# Altium schematic sheet Motor Controller.SchDoc: Motor Controller
size A2; Author: Adin Ackerman; DrawnBy: Adin Ackerman; SheetNumber: 1; SheetTotal: 1
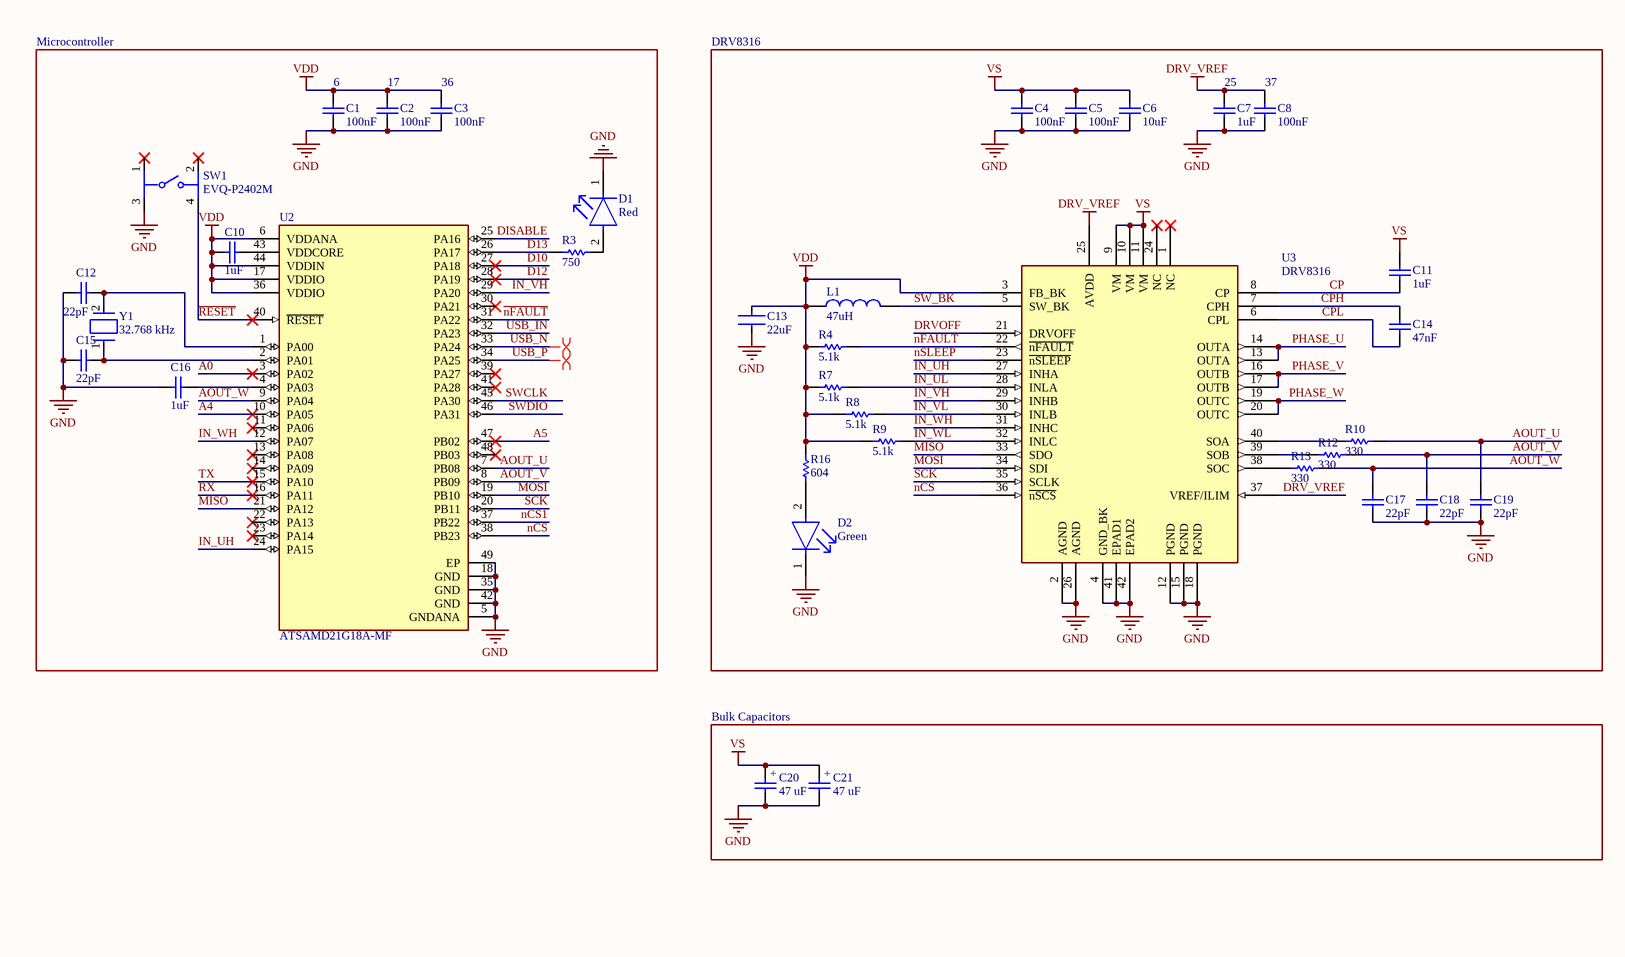
[diagram p0: Motor Controller.SchDoc, left]
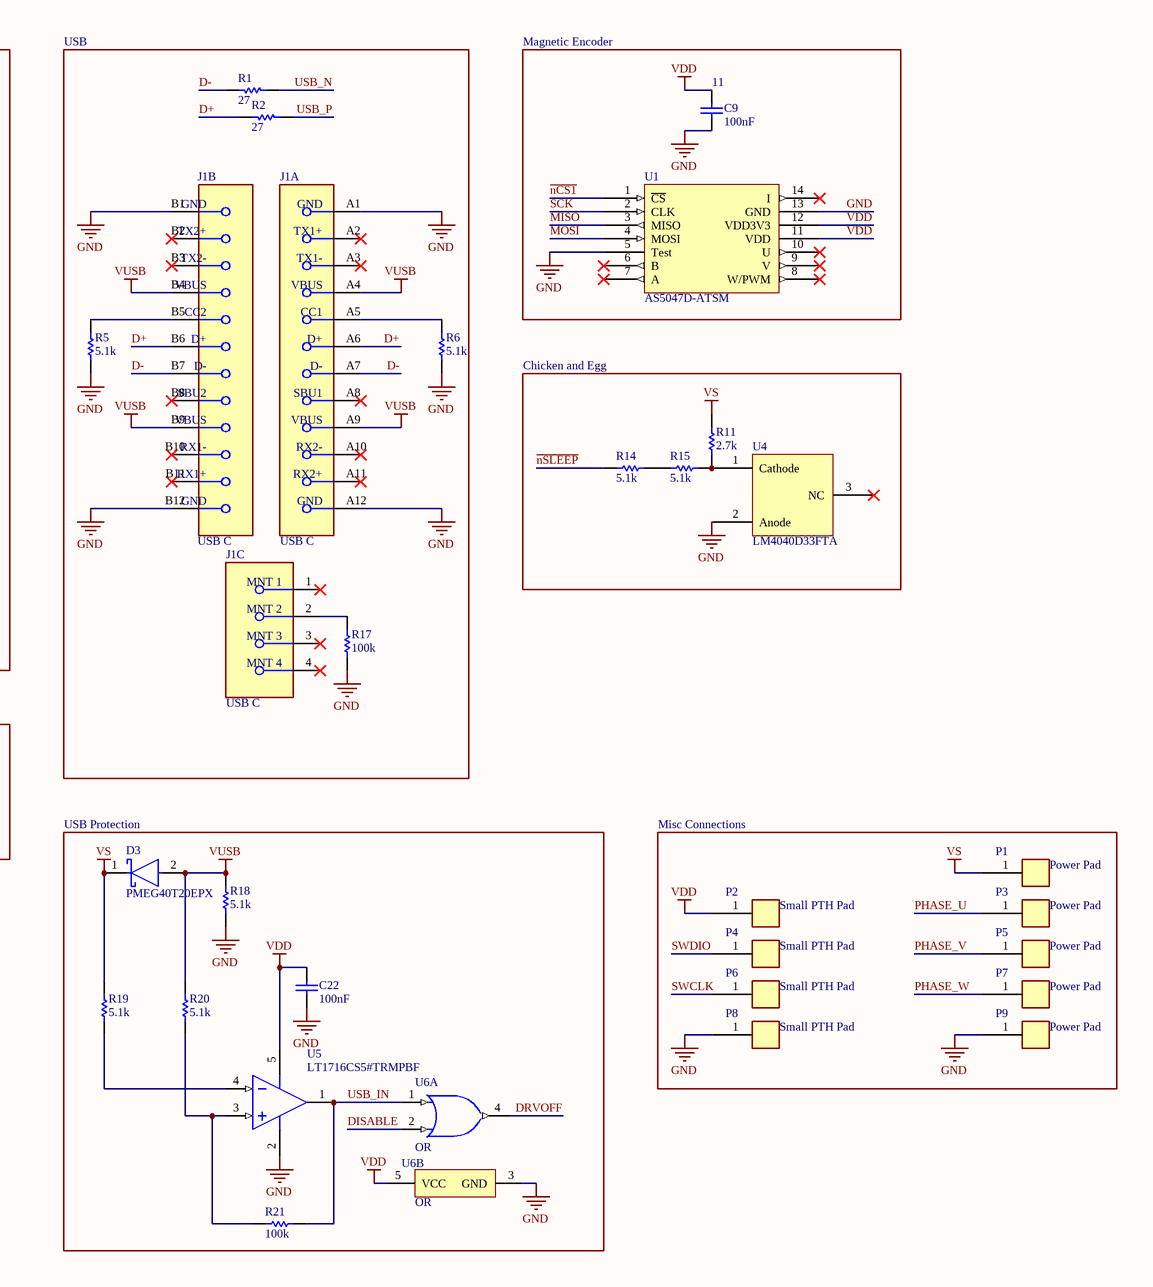
[diagram p1: Motor Controller.SchDoc, right]

## Parts
C1  100nF  [0402CAP]
C2  100nF  [0402CAP]
C3  100nF  [0402CAP]
C4  100nF  [0402CAP]
C5  100nF  [0402CAP]
C6  10uF  [FP-GRT31C-0_2-IPC_B]
C7  1uF  [0603CAP]
C8  100nF  [0402CAP]
C9  100nF  [0402CAP]
C10  1uF  [0603CAP]
C11  1uF  [0603CAP]
C12  22pF  [0402CAP]
C13  22uF  [FP-GRM319-0_15-MFG]
C14  47nF  [FP-GRM155-0_05-MFG]
C15  22pF  [0402CAP]
C16  1uF  [0603CAP]
C17  22pF  [0402CAP]
C18  22pF  [0402CAP]
C19  22pF  [0402CAP]
C20  47 uF  [CAPAE7866X61N]
C21  47 uF  [CAPAE7866X61N]
C22  100nF  [0402CAP]
D1  Red  [FP-APT1608LSECK-J3-PRV-MFG]
D2  Green  [FP-APT1608MGC-MFG]
D3  PMEG40T20EPX  [SODFL470X110-2N]
J1  USB C  [FP-1054500101-MFG]  (parts A,B,C of 3)
L1  47uH  [INDC3225X25N]
P1  Power Pad  [Power Pad]
P2  Small PTH Pad  [Small PTH Pad]
P3  Power Pad  [Power Pad]
P4  Small PTH Pad  [Small PTH Pad]
P5  Power Pad  [Power Pad]
P6  Small PTH Pad  [Small PTH Pad]
P7  Power Pad  [Power Pad]
P8  Small PTH Pad  [Small PTH Pad]
P9  Power Pad  [Power Pad]
R1  27  [RESC1005X40X25LL05T05]
R2  27  [RESC1005X40X25LL05T05]
R3  750  [RESC1005X40X25LL05T05]
R4  5.1k  [RESC1005X40X25LL05T05]
R5  5.1k  [RESC1005X40X25LL05T05]
R6  5.1k  [RESC1005X40X25LL05T05]
R7  5.1k  [RESC1005X40X25LL05T05]
R8  5.1k  [RESC1005X40X25LL05T05]
R9  5.1k  [RESC1005X40X25LL05T05]
R10  330  [RESC1005X40X25LL05T05]
R11  2.7k  [RESC1005X40X25LL05T05]
R12  330  [RESC1005X40X25LL05T05]
R13  330  [RESC1005X40X25LL05T05]
R14  5.1k  [RESC1005X40X25LL05T05]
R15  5.1k  [RESC1005X40X25LL05T05]
R16  604  [RESC1005X40X25LL05T05]
R17  100k  [RESC1005X40X25LL05T05]
R18  5.1k  [RESC1005X40X25LL05T05]
R19  5.1k  [RESC1005X40X25LL05T05]
R20  5.1k  [RESC1005X40X25LL05T05]
R21  100k  [RESC1005X40X25LL05T05]
SW1  EVQ-P2402M  [EVQ-P2402M]
U1  AS5047D-ATSM  [TSOP65P640X120-14N]
U2  ATSAMD21G18A-MF  [QFN-48]
U3  DRV8316  [QFN50P500X700X100_HS-41L]
U4  LM4040D33FTA  [SOT65P210X100-3N]
U5  LT1716CS5#TRMPBF  [SOT95P280X100-5N]
U6  OR  [DBV0005A_M]  (parts A,B of 2)
Y1  32.768 kHz  [ABS05W-32.768KHZ-D-2-T]

## Blocks framed on the sheet
USB: J1 R1 R2 R5 R6 R17
Chicken and Egg: R11 R14 R15 U4
Bulk Capacitors: C20 C21
USB Protection: C22 D3 R18-R21 U5 U6
Misc Connections: P1-P9

## Nets
DRV_VREF: C7.2 C8.2 U3.25(AVDD) U3.37(VREF/ILIM)
GND: C1.1 C2.1 C3.1 C4.1 C5.1 C6.1 C7.1 C8.1 C9.1 C12.1 C13.2 C15.1 C16.1 C17.1 C18.1 C19.1 C20.2 C21.2 C22.1 D1.1(C) D2.1(C) J1.A1(GND) J1.A12(GND) J1.B1(GND) J1.B12(GND) P8.1 P9.1 R5.2 R6.2 R17.1 R18.1 SW1.3 U1.5(Test) U1.13(GND) U2.5(GNDANA) U2.18(GND) U2.35(GND) U2.42(GND) U2.49(EP) U3.2(AGND) U3.4(GND_BK) U3.12(PGND) U3.15(PGND) U3.18(PGND) U3.26(AGND) U3.41(EPAD1) U3.42(EPAD2) U4.2(Anode) U5.2(V-) U6.3(GND)
VDD: C1.2 C2.2 C3.2 C9.2 C10.2 C13.1 C22.2 L1.1 P2.1 R4.1 R7.1 R8.1 R9.1 R16.2 U1.11(VDD) U1.12(VDD3V3) U2.6(VDDANA) U2.17(VDDIO) U2.36(VDDIO) U2.44(VDDIN) U3.3(FB_BK) U5.5(V+) U6.5(VCC)
VS: C4.2 C5.2 C6.2 C11.2 C20.1 C21.1 D3.1(C) P1.1 R11.2 R19.2 U3.9(VM) U3.10(VM) U3.11(VM)
VUSB: D3.2(A) J1.A4(VBUS) J1.A9(VBUS) J1.B4(VBUS) J1.B9(VBUS) R18.2 R20.2
~{nCS}: U2.38(PB23) U3.36(~{nSCS})
~{nCS1}: U1.1(~{CS}) U2.37(PB22)
~{nFAULT}: R4.2 U2.31(PA22) U3.22(~{nFAULT})
~{nSLEEP}: R14.1 U3.23(~{nSLEEP})
~{RESET}: SW1.4 U2.40(~{RESET})
A0: U2.3(PA02)
A4: U2.10(PA05)
A5: U2.47(PB02)
AOUT_U: C19.2 R10.2 U2.7(PB08)
AOUT_V: C18.2 R12.2 U2.8(PB09)
AOUT_W: C17.2 R13.2 U2.9(PA04)
CP: C11.1 U3.8(CP)
CPH: C14.2 U3.7(CPH)
CPL: C14.1 U3.6(CPL)
D10: U2.27(PA18)
D12: U2.28(PA19)
D13: R3.1 U2.26(PA17)
D+: J1.A6(D+) J1.B6(D+) R2.2
D-: J1.A7(D-) J1.B7(D-) R1.2
DISABLE: U2.25(PA16) U6.2(B)
DRVOFF: U3.21(DRVOFF) U6.4(Y)
IN_UH: U2.24(PA15) U3.27(INHA)
IN_UL: R7.2 U3.28(INLA)
IN_VH: U2.29(PA20) U3.29(INHB)
IN_VL: R8.2 U3.30(INLB)
IN_WH: U2.12(PA07) U3.31(INHC)
IN_WL: R9.2 U3.32(INLC)
MISO: U1.3(MISO) U2.21(PA12) U3.33(SDO)
MOSI: U1.4(MOSI) U2.19(PB10) U3.34(SDI)
PHASE_U: P3.1 U3.13(OUTA) U3.14(OUTA)
PHASE_V: P5.1 U3.16(OUTB) U3.17(OUTB)
PHASE_W: P7.1 U3.19(OUTC) U3.20(OUTC)
RX: U2.16(PA11)
SCK: U1.2(CLK) U2.20(PB11) U3.35(SCLK)
SW_BK: L1.2 U3.5(SW_BK)
SWCLK: P6.1 U2.45(PA30)
SWDIO: P4.1 U2.46(PA31)
TX: U2.15(PA10)
USB_IN: R21.2 U2.32(PA23) U5.1(OUT) U6.1(A)
USB_N: R1.1 U2.33(PA24)
USB_P: R2.1 U2.34(PA25)
NetC10_1: C10.1 U2.43(VDDCORE)
NetC12_2: C12.2 U2.1(PA00) Y1.2
NetC15_2: C15.2 U2.2(PA01) Y1.1
NetC16_2: C16.2 U2.4(PA03)
NetD1_2: D1.2(A) R3.2
NetD2_2: D2.2(A) R16.1
NetJ1_2: J1.2(MNT_2) R17.2
NetJ1_A5: J1.A5(CC1) R6.1
NetJ1_B5: J1.B5(CC2) R5.1
NetR10_1: R10.1 U3.40(SOA)
NetR11_1: R11.1 R15.2 U4.1(Cathode)
NetR12_1: R12.1 U3.39(SOB)
NetR13_1: R13.1 U3.38(SOC)
NetR14_2: R14.2 R15.1
NetR19_1: R19.1 U5.4(-IN)
NetR20_1: R20.1 R21.1 U5.3(+IN)

Not connected (* = marked no-connect by the designer): J1 1(MNT_1)* 3(MNT_3)* 4(MNT_4)* A2(TX1+)* A3(TX1-)* A8(SBU1)* A10(RX2-)* A11(RX2+)* B2(TX2+)* B3(TX2-)* B8(SBU2)* B10(RX1-)* B11(RX1+)*; SW1 1* 2*; U1 6(B)* 7(A)* 8(W/PWM)* 9(V)* 10(U)* 14(I)*; U2 11(PA06)* 13(PA08)* 14(PA09)* 22(PA13)* 23(PA14)* 30(PA21)* 39(PA27)* 41(PA28)* 48(PB03)*; U3 1(NC)* 24(NC)*; U4 3(NC)*

## Layout directives
differential pair: USB_N, USB_P

## Notes on the sheet
- Microcontroller
- DRV8316
- Magnetic Encoder
- (near C1) 6
- (near C2) 17
- (near C3) 36
- (near C7) 25
- (near C8) 37
- (near C9) 11
- (in symbol EEE-FT1H470AL) +

## Library data of the parts
C1-C5 C8 C9 C22 = GCM155R71H104KE02D: Supplier 1: Digi-Key; Supplier Part Number 1: 490-10672-1-ND
C6 = GRT31CR61H106ME01L: Supplier 1: Digi-Key; Supplier Part Number 1: 490-12457-1-ND
C7 C10 C11 C16 = GRT188R61H105ME13D: Supplier 1: Digi-Key; Supplier Part Number 1: 490-12331-1-ND
C12 C15 C17-C19 = C0402C220J5GAC7411: Supplier 1: Digi-Key; Supplier Part Number 1: 399-C0402C220J5GAC7411CT-ND
C13 = GRM319R61C226ME15D: Multilayer Ceramic Capacitors 22uF ±10% 16V X7R SMD 1210; Voltage Rating (DC): 16V; RoHS Compliant: Yes; Thickness: 0.11inch; Packaging: Tape and Reel; Voltage: 16V; Length: 3.2mm; Radiation Hardening: No; Case/Package: 1210; Tolerance: 10%; Package Quantity: 1; Series: C; Capacitance: 22uF; Lead Free: Lead Free; Voltage Rating: 16V; Number of Pins: 2; Weight: 0.000564oz; Height: 2.5mm; Case Code (Metric): 3225; Depth: 2.5mm; Min Operating Temperature: -55°C; Termination: SMD/SMT; Dielectric Material: Ceramic; Mount: Surface Mount; Resistor Type: Ceramic; Max Operating Temperature: 125°C; Construction: Flat; Dielectric: X7R; Width: 0.098inch; REACH SVHC: No SVHC; Case Code (Imperial): 1210; Supplier 1: Digi-Key; Supplier Part Number 1: 490-12763-1-ND
C14 = GRM155R71H473KE14D: Chip Capacitor, 47 nF, +/- 10%, 50 V, -55 to 125 degC, 0402 (1005 Metric), RoHS, Tape and Reel; Manufacturer: TDK; PCN Part Number: MLCCPartNumberChange30/Nov/2012; Kits: 445-9021-KIT-ND-KITMLCC100PF-10UF04026.3-50V445-173086-KIT-ND-C0402-2220X7R6.3-50V1,000PF-; Temperature Coefficient: X7R; Voltage - Rated: 50V; Product Training Modules: CSeriesGeneralApplicationsSEAT,CCV,andTVCLDesignToolsGuidetoReplacinganElectrolyticCapacitorwithanMLCC; Other Names: 445-7336-1; Capacitance: 0.047µF; Online Catalog: CSeries,GeneralPurpose; Standard Package: 1; Manufacturer URL: http://www.tdk.com/; Category: Capacitors; Operating Temperature: -55°C~125°C; Datasheet Version: 08/2016; Tolerance: ±10%; Series: C; Mounting Technology: SurfaceMount; Mounting Type: SurfaceMount,MLCC; Packaging: CutTape(CT); Height - Seated (Max): -; Package Description: 2-Pin Surface Mount Device, Body 1 x 0.5 mm; Applications: GeneralPurpose; Thickness (Max): 0.022"(0.55mm); Datasheet URL: https://product.tdk.com/info/en/catalog/datasheets/mlcc_commercial_general_en.pdf; Ratings: -; Package Reference: 1005; Lead Spacing: -; Family: CeramicCapacitors; Lead Style: -; Size / Dimension: 0.039"Lx0.020"W(1.00mmx0.50mm); RoHS Information: RoHSCertificate-MLCC; Package / Case: 0402(1005Metric); Features: -; Supplier 1: Digi-Key; Supplier Part Number 1: 490-10702-1-ND
C20 C21 = EEE-FT1H470AL: Supplier 1: Digi-Key; Supplier Part Number 1: 10-EEE-FT1H470ALCT-ND
D1 = APT1608LSECK/J3-PRV: LED RED CLEAR 2SMD; Dominant Wavelength: 625nm; Lens Color: Colorless; Forward Voltage: 1.8V; Luminous Intensity: 40mcd; Viewing Angle: 120°; Test Current: 2mA; Width: 0.8mm; Case Code (Metric): 1608; Color: Red; Lens Transparency: Clear; Mount: Surface Mount; Height: 0.75mm; Case/Package: 0603; Length: 1.6mm; Packaging: Tape and Reel; Case Code (Imperial): 0603; Supplier 1: Digi-Key; Supplier Part Number 1: 754-1930-1-ND
D2 = APT1608MGC: LED GREEN CLEAR CHIP SMD; Forward Voltage: 2.1V; Dominant Wavelength: 570nm; Viewing Angle: 120°; Forward Current: 20mA; Luminous Intensity: 70mcd; Max Operating Temperature: 85°C; Case Code (Imperial): 0603; Lens Style: Clear; Height: 0.75mm; Package Quantity: 2000; Width: 0.8mm; Case Code (Metric): 1608; Lead Free: Lead Free; Mount: Surface Mount; Length: 1.6mm; Illumination Color: Green; Min Operating Temperature: -40°C; Test Current: 20mA; Lens Color: Clear; Color: Green; Packaging: Tape and Reel; Case/Package: 0603; Supplier 1: Digi-Key; Supplier Part Number 1: 754-1118-1-ND
J1 = 1054500101: CONN RCP USB3.1 TYPEC 24P SMD RA; Manufacturer: Molex; Number Of Contacts: 24; Voltage Rating: 30V; Shielding: true; Is Female: yes; Current Rating: 0.25/1.25/5A; Pitch: 0.5mm; Conn Orientation: Right Angle; Package: 0; Height: 3.44mm; Footprint Url: https://www.molex.com/pdm_docs/sd/1054500101_sd.pdf; Device Class L1: Connectors; Category: Conn; Device Class L2: USB Connectors; Digikey Description: CONN RCP USB3.1 TYPEC 24P SMD RA; Contact Material: Gold,Nickel; Mouser Description: USB Shielded I/O Receptacle; Type C; Right Angle; Surface Mount; Gold over Nickel; ComponentLink2Description: Datasheet; Lead Free: Yes; Automotive: No; Temperature Range High: +85°C; RoHS: TRUE; Octopart: https://octopart.com/105450-0101-molex-68082325; ComponentLink2URL: https://www.molex.com/webdocs/datasheets/pdf/en-us/1054500101_IO_CONNECTORS.pdf; Temperature: -30°C to +85°C; Usb Standard: USB 3.1; Temperature Range Low: -30°C; Device Class L3: unset; Manufacturer Part Number: 1054500101; Supplier 1: Digi-Key; Supplier Part Number 1: WM12856CT-ND
L1 = L1210R470KDWIT: Supplier 1: Newark; Supplier Part Number 1: 50AC9370
R1 R2 = ERJ2RKD27R0X: Supplier 1: RSComponents; Supplier Part Number 1: 8072299
R3 = ERJ-2RKF7500X: Supplier 1: Digi-Key; Supplier Part Number 1: P750LCT-ND
R4-R9 R14 R15 R18-R20 = ERJ-2RKF5101X: PANASONIC - ERJ2RKF5101X - SMD Chip Resistor, 0402 [1005 Metric], 5.1 kohm, ERJ2R Series, 50 V, Thick Film, 100 mW; PartNumber: ERJ-2RKF4701X; Resistance: 4.7 KOhm; Tolerance: 1%; Voltage Rating: 50 V; Case\/Package: 0402; Power Rating: 100 mW; Height: 0.35 mm; Mounting Technology: Surface Mount; REACH SVHC: Yes; Max Operating Temperature: 155 degC; ComponentLink1Description: Manufacturer URL; ComponentLink2Description: Datasheet; Pins: 2; PackageReference: 0402; Case Code (Imperial): 0402; Length: 1 mm; PackageDescription: 2-Pin Surface Mount Device, Body 1 x 0.5 mm; RoHSCompliant: true; Package Quantity: 1; Radiation Hardening: No; DatasheetVersion: 04/2015; Width: 0.5 mm; Case Code (Metric): 1005; Mount: Surface Mount; ComponentLink1URL: http://www.panasonic.com/; Min Operating Temperature: -55 degC; Packaging: Cut Tape; ComponentLink2URL: http://industrial.panasonic.com/cdbs/www-data/pdf/RDA0000/AOA0000C86.pdf; Supplier 1: Digi-Key; Supplier Part Number 1: P5.10KLCT-ND
R10 R12 R13 = ERJ2RKF3300X: Manufacturer: Panasonic; Part Number: ERJ2RKF3300X
R11 = ERJ2RKF2701X: Manufacturer: Panasonic; Part Number: ERJ2RKF2701X; Supplier 1: Digi-Key
R16 = ERJ-2RKF6040X: Manufacturer: Panasonic; Part Number: ERJ-2RKF6040X; Supplier 1: Digi-Key; Supplier Part Number 1: P604LCT-ND
R17 R21 = ERJ2RHD1003X: Supplier 1: Newark; Supplier Part Number 1: 85Y7989
U5 = LT1716CS5#TRMPBF: SOT-23, 44 V, Over-the-Top, Micropower, Precision Rail-to-Rail Comparator, 1 Channel, 2.7 to 44 V, 0 to +70 degC, 5-pin Plastic TSOT-23 (S5), Mini Tape and Reel; Generic Part Number: LT1716; Manufacturer: Linear Technology; Vos (mV) Guaranteed: 1.6; Channels (#): 1; Prop Delay (us): 3; Supply Current (uA) Typical: 50; Vos (mV) Typical: 0.3; Vs Min (V): 2.7; Vs Max (V): 44; PackageDescription: 5-Pin Plastic TSOT-23, Body 2.9 x 1.63 mm, Pitch 0.95 mm; DatasheetVersion: Rev A; Supply Voltage Range: 2.7 to 44 V; RoHS: Y; ComponentLink3URL: http://cds.linear.com/docs/en/packaging/SOT_5_05-08-1635.pdf; ComponentLink2URL: http://cds.linear.com/docs/en/datasheet/1716fa.pdf; ComponentLink2Description: Datasheet; Code_JEDEC: MO-193; ComponentLink3Description: Package Specification; Mounting Technology: Surface Mount; PartNumber: LT1716CS5#TRMPBF; ComponentLink1Description: Manufacturer URL; PackageReference: S5; Features: Comparator, Over-the-Top Inputs, Rail-to-Rail Out; ComponentLink1URL: http://www.linear.com/; Supplier 1: Digi-Key; Supplier Part Number 1: LT1716CS5#TRMPBFCT-ND
U6 = SN74LV1T32DBVR: Single Power Supply 2-INPUT POSITIVE OR GATE with Logic Level Shifter, DBV0005A, LARGE T&R; Manufacturer: Texas Instruments; Voltage(Nom)(V): 1.8,2.5,3.3,5.5; Output Drive (IOL/IOH)(Max)(mA): 8/-8; Input Type: TTL; Schmitt Trigger: No; Special Features: 1.8V to 3.3V Up Translation,3.3V to 1.8V Down Translation,5V Input Tolerant; 3-State Output: Yes; ICC @ Nom Voltage(Max)(mA): 0.01; F @ Nom Voltage(Max)(Mhz): 50; tpd @ Nom Voltage(Max)(ns): 13,7.5,5.5,7.0; Bits(#): 1; Output Type: CMOS; Rating: Catalog; Technology Family: LV1T; VCC(Min)(V): 1.6; Sub-Family: OR Gate; Logic: True; VCC(Max)(V): 5.5; Operating Temperature Range(C): -40 to 125; Generic Part Number: SN74LV1T32; DatasheetVersion: SCLS741A; PackageReference: DBV0005A; Supplier 1: Digi-Key; Supplier Part Number 1: 296-37201-1-ND
Y1 = ABS05W-32.768KHZ-D-2-T: Crystal Oscillator; Supplier 1: Digi-Key; Supplier Part Number 1: 535-14310-1-ND
D3 = PMEG40T20EPX: Supplier 1: Digi-Key; Supplier Part Number 1: 1727-7480-1-ND
SW1 = EVQ-P2402M: Supplier 1: Digi-Key; Supplier Part Number 1: P11080SCT-ND
U1 = AS5047D-ATSM: Supplier 1: Digi-Key; Supplier Part Number 1: AS5047D-ATSMCT-ND
U4 = LM4040D33FTA: Supplier 1: Mouser; Supplier Part Number 1: 621-LM4040D33FTA